# Altium schematic sheet Chipset.SchDoc
size 594 x 420 mm
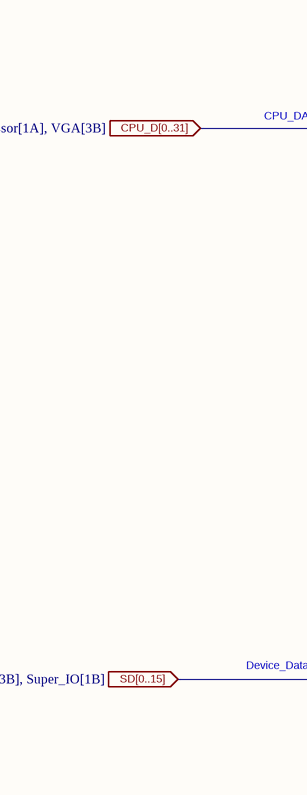
[diagram p0: Chipset.SchDoc, top left]
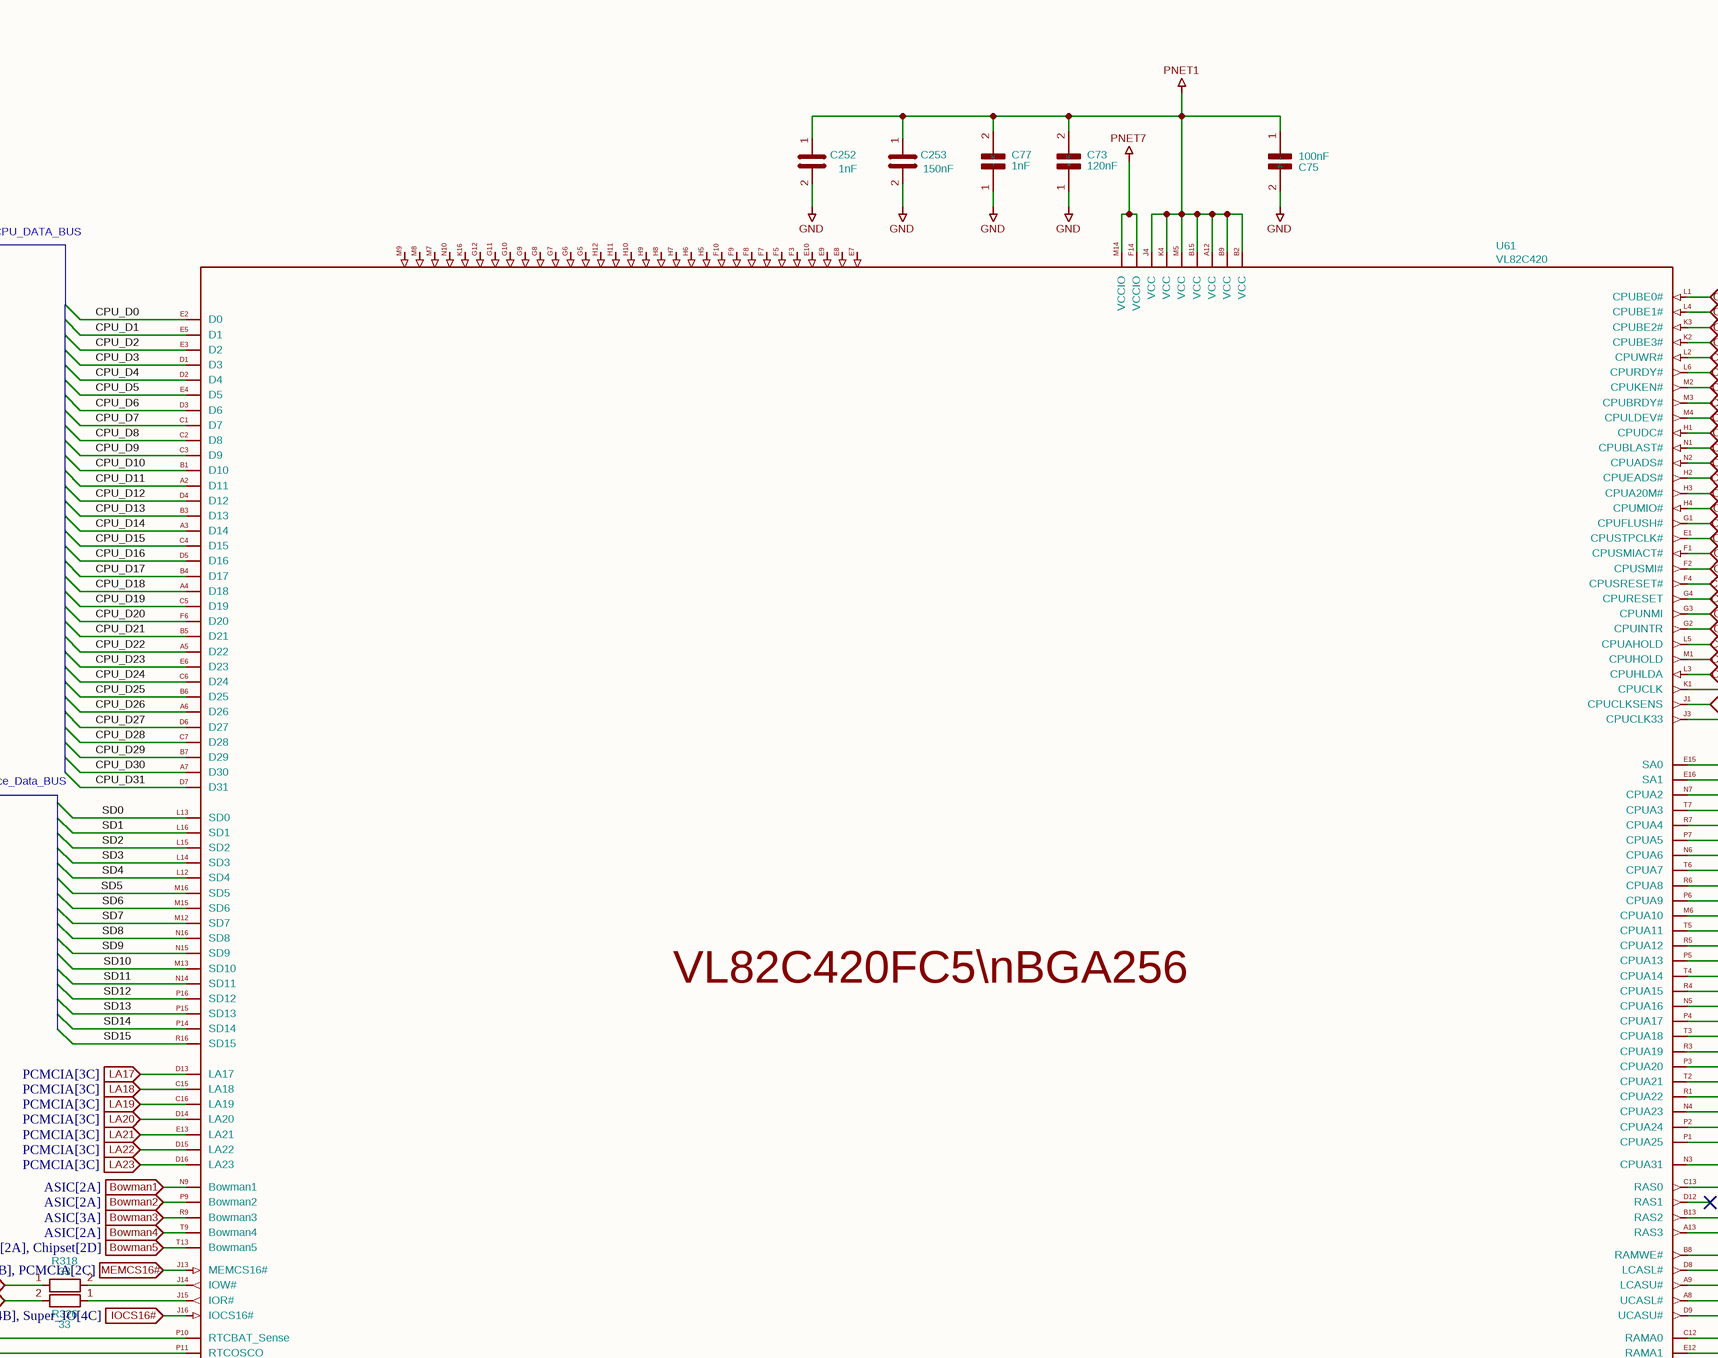
[diagram p1: Chipset.SchDoc, top middle]
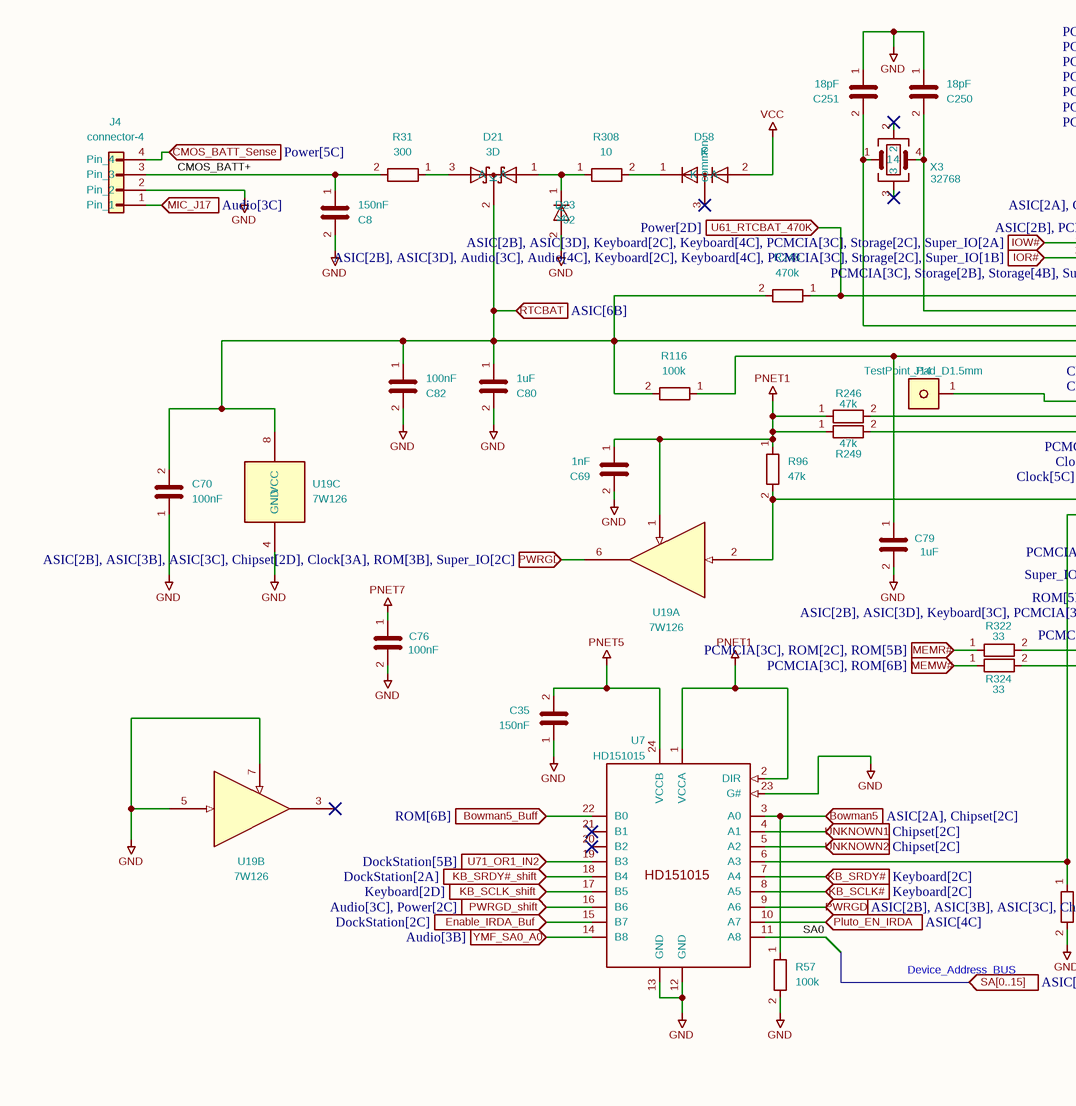
[diagram p2: Chipset.SchDoc, bottom left]
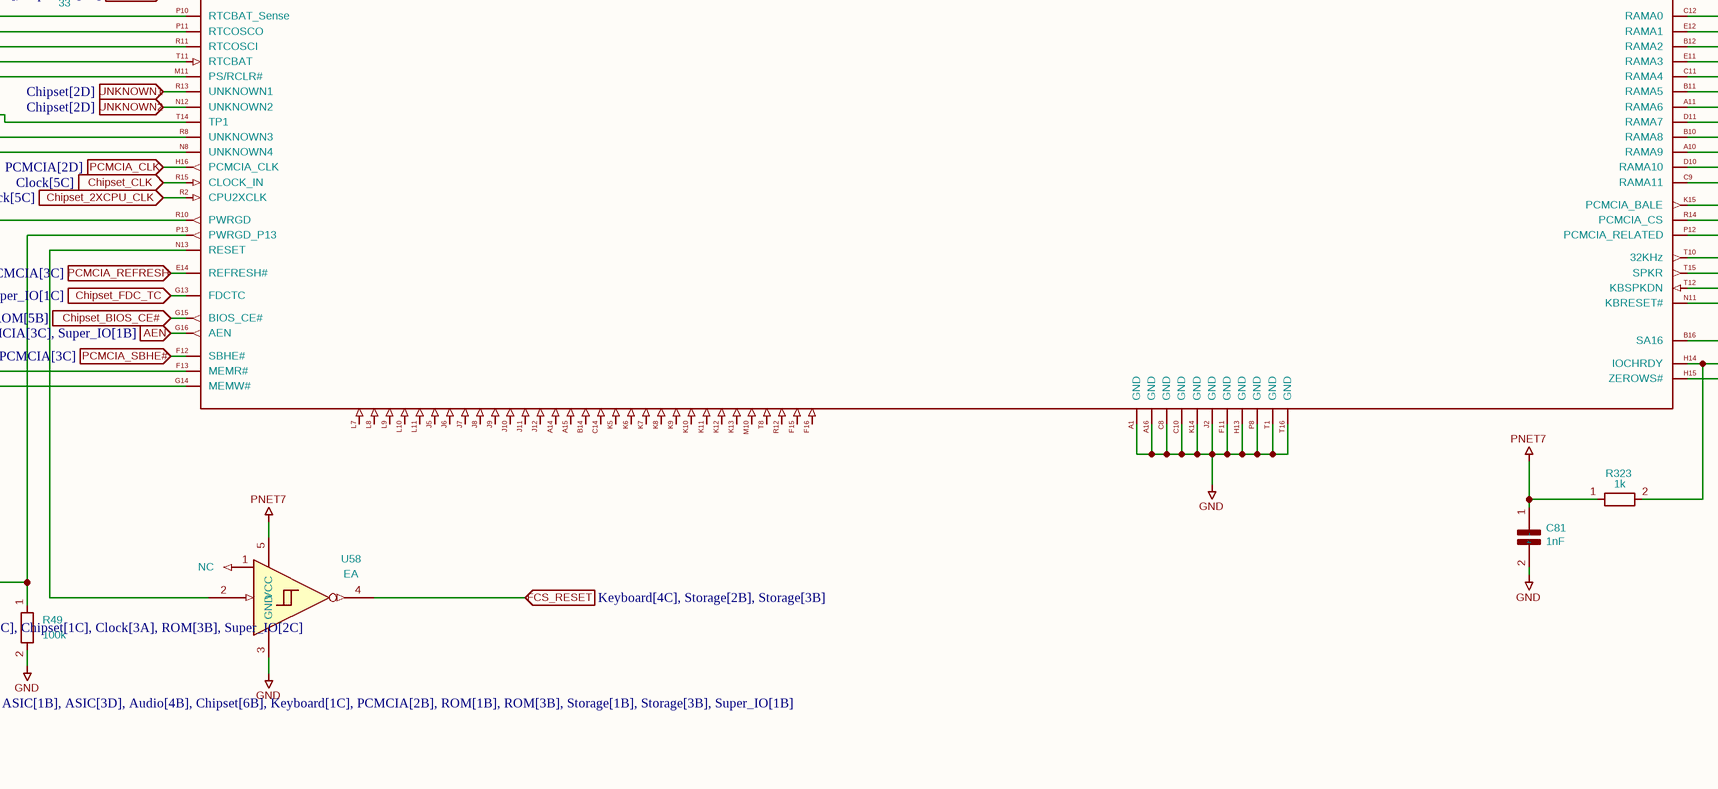
[diagram p3: Chipset.SchDoc, bottom middle]
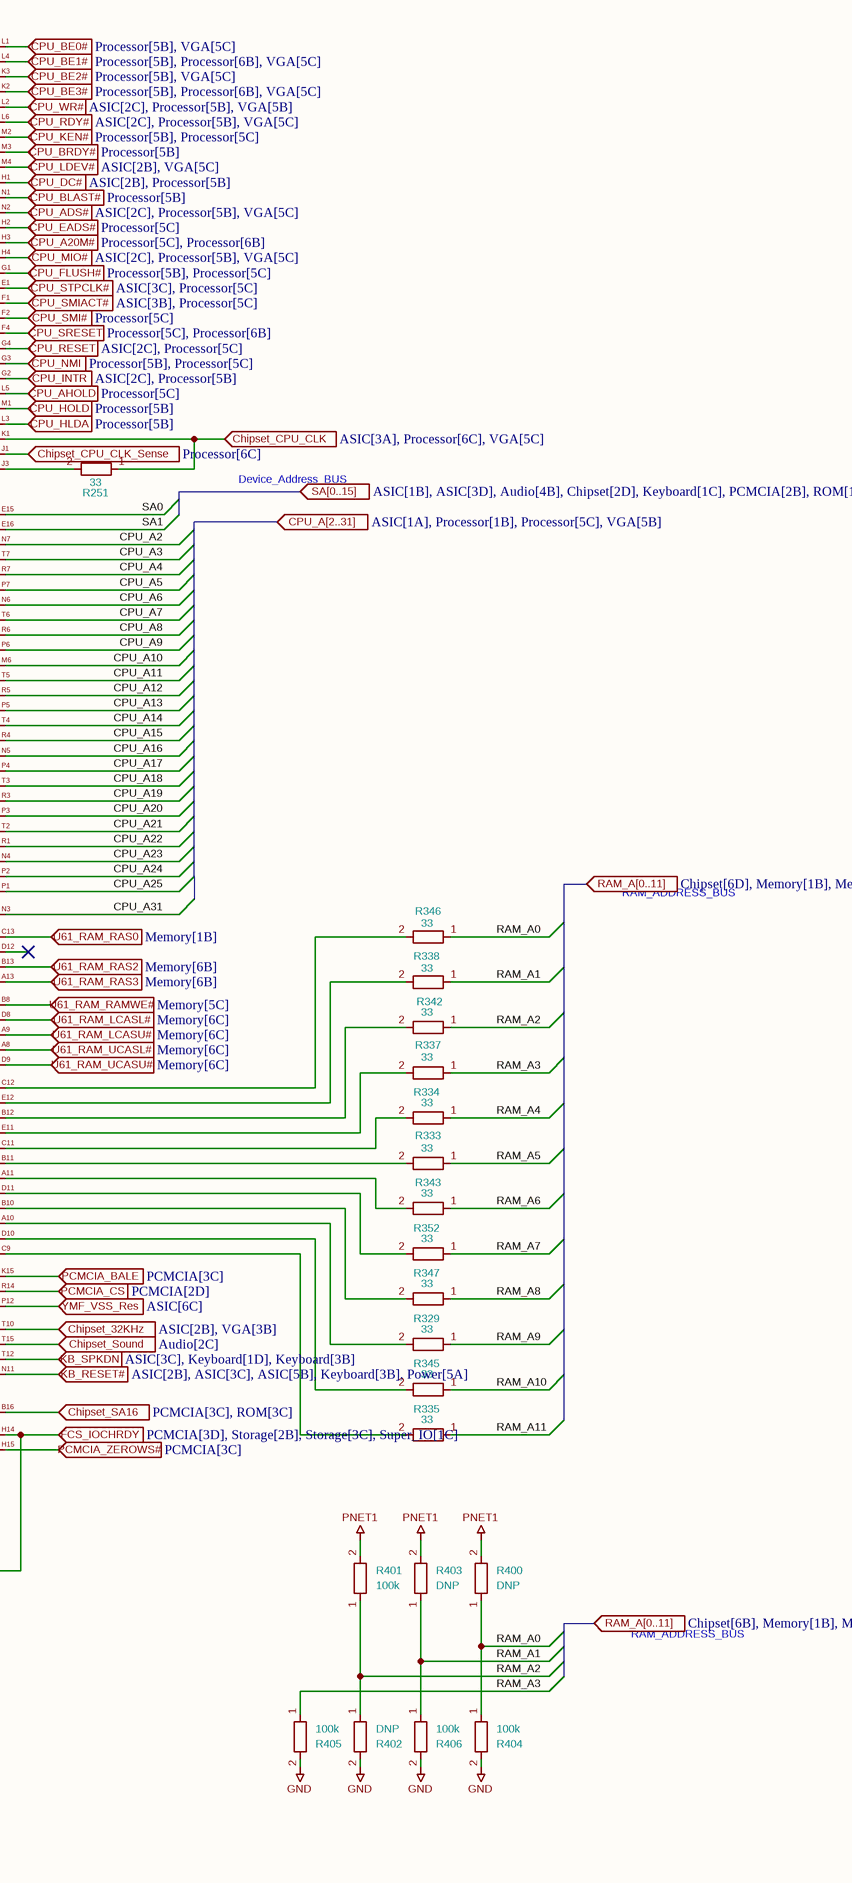
[diagram p4: Chipset.SchDoc, bottom right]

## Parts
C8  150nF  [C_0402_1005Metric]
C35  150nF  [C_0402_1005Metric]
C69  1nF  [C_0402_1005Metric]
C70  100nF  [C_0402_1005Metric]
C73  120nF  [C_0402_1005Metric]
C75  100nF  [C_0402_1005Metric]
C76  100nF  [C_0402_1005Metric]
C77  1nF  [C_0402_1005Metric]
C79  1uF  [C_0603_1608Metric]
C80  1uF  [C_0603_1608Metric]
C81  1nF  [C_0402_1005Metric]
C82  100nF  [C_0402_1005Metric]
C250  18pF  [C_0402_1005Metric]
C251  18pF  [C_0402_1005Metric]
C252  1nF  [C_0402_1005Metric]
C253  150nF  [C_0402_1005Metric]
D21  3D  [3D]
D23  92  [D_0603_1608Metric]
D58  K  [SOT-416L]
J4  connector-4  [connector-4]
J14  TestPoint_Pad_D1.5mm  [TestPoint_Pad_D1.5mm]
R31  300  [R_0402_1005Metric]
R49  100k  [R_0402_1005Metric]
R57  100k  [R_0402_1005Metric]
R96  47k  [R_0402_1005Metric]
R116  100k  [R_0402_1005Metric]
R246  47k  [R_0402_1005Metric]
R248  470k  [R_0402_1005Metric]
R249  47k  [R_0402_1005Metric]
R251  33  [R_0402_1005Metric]
R308  10  [R_0402_1005Metric]
R318  33  [R_0402_1005Metric]
R322  33  [R_0402_1005Metric]
R323  1k  [R_0402_1005Metric]
R324  33  [R_0402_1005Metric]
R326  33  [R_0402_1005Metric]
R329  33  [R_0402_1005Metric]
R333  33  [R_0402_1005Metric]
R334  33  [R_0402_1005Metric]
R335  33  [R_0402_1005Metric]
R337  33  [R_0402_1005Metric]
R338  33  [R_0402_1005Metric]
R342  33  [R_0402_1005Metric]
R343  33  [R_0402_1005Metric]
R345  33  [R_0402_1005Metric]
R346  33  [R_0402_1005Metric]
R347  33  [R_0402_1005Metric]
R352  33  [R_0402_1005Metric]
R400  DNP  [R_0402_1005Metric]
R401  100k  [R_0402_1005Metric]
R402  DNP  [R_0402_1005Metric]
R403  DNP  [R_0402_1005Metric]
R404  100k  [R_0402_1005Metric]
R405  100k  [R_0402_1005Metric]
R406  100k  [R_0402_1005Metric]
U7  HD151015  [TSSOP-24_6.1x7.8mm_P0.65mm]
U19  7W126  [sso-8]  (parts A,B,C of 3)
U58  EA  [SOT-353]
U61  VL82C420  [BGA-256]
X3  32768  [XTAL-3]

## Ports
AEN (in, see ASIC[2B], ASIC[3D], Keyboard[3C], PCMCIA[3C], Super_IO[1B]), Bowman1 (in, see ASIC[2A]), Bowman2 (in, see ASIC[2A]), Bowman3 (in, see ASIC[3A]), Bowman4 (in, see ASIC[2A]), Bowman5 (in, see ASIC[2A], Chipset[2C]), Bowman5 (in, see ASIC[2A], Chipset[2D]), Bowman5_Buff (in, see ROM[6B]), Chipset_2XCPU_CLK (in, see Clock[5C]), Chipset_32KHz (in, see ASIC[2B], VGA[3B]), Chipset_BIOS_CE# (in, see ROM[5B]), Chipset_CLK (in, see Clock[5C]), Chipset_CPU_CLK (in, see ASIC[3A], Processor[6C], VGA[5C]), Chipset_CPU_CLK_Sense (in, see Processor[6C]), Chipset_FDC_TC (in, see Super_IO[1C]), Chipset_SA16 (in, see PCMCIA[3C], ROM[3C]), Chipset_Sound (in, see Audio[2C]), CMOS_BATT_Sense (in, see Power[5C]), CPU_A20M# (in, see Processor[5C], Processor[6B]), CPU_A[2..31] (in, see ASIC[1A], Processor[1B], Processor[5C], VGA[5B]), CPU_ADS# (in, see ASIC[2C], Processor[5B], VGA[5C]), CPU_AHOLD (in, see Processor[5C]), CPU_BE0# (in, see Processor[5B], VGA[5C]), CPU_BE1# (in, see Processor[5B], Processor[6B], VGA[5C]), CPU_BE2# (in, see Processor[5B], VGA[5C]), CPU_BE3# (in, see Processor[5B], Processor[6B], VGA[5C]), CPU_BLAST# (in, see Processor[5B]), CPU_BRDY# (in, see Processor[5B]), CPU_D[0..31] (in, see Memory[3B], Memory[3C], Processor[1A], VGA[3B]), CPU_DC# (in, see ASIC[2B], Processor[5B]), CPU_EADS# (in, see Processor[5C]), CPU_FLUSH# (in, see Processor[5B], Processor[5C]), CPU_HLDA (in, see Processor[5B]), CPU_HOLD (in, see Processor[5B]), CPU_INTR (in, see ASIC[2C], Processor[5B]), CPU_KEN# (in, see Processor[5B], Processor[5C]), CPU_LDEV# (in, see ASIC[2B], VGA[5C]), CPU_MIO# (in, see ASIC[2C], Processor[5B], VGA[5C]), CPU_NMI (in, see Processor[5B], Processor[5C]), CPU_RDY# (in, see ASIC[2C], Processor[5B], VGA[5C]), CPU_RESET (in, see ASIC[2C], Processor[5C]), CPU_SMI# (in, see Processor[5C]), CPU_SMIACT# (in, see ASIC[3B], Processor[5C]), CPU_SRESET (in, see Processor[5C], Processor[6B]), CPU_STPCLK# (in, see ASIC[3C], Processor[5C]), CPU_WR# (in, see ASIC[2C], Processor[5B], VGA[5B]), Enable_IRDA_Buf (in, see DockStation[2C]), FCS_IOCHRDY (in, see PCMCIA[3D], Storage[2B], Storage[3C], Super_IO[1C]), FCS_RESET (in, see Keyboard[4C], Storage[2B], Storage[3B]), IOCS16# (in, see PCMCIA[3C], Storage[2B], Storage[4B], Super_IO[4C]), IOR# (in, see ASIC[2B], ASIC[3D], Audio[3C], Audio[4C], Keyboard[2C], Keyboard[4C], PCMCIA[3C], Storage[2C], Super_IO[1B]), IOW# (in, see ASIC[2B], ASIC[3D], Keyboard[2C], Keyboard[4C], PCMCIA[3C], Storage[2C], Super_IO[2A]), KB_RESET# (in, see ASIC[2B], ASIC[3C], ASIC[5B], Keyboard[3B], Power[5A]), KB_SCLK# (in, see Keyboard[2C]), KB_SCLK_shift (in, see Keyboard[2D]), KB_SPKDN (in, see ASIC[3C], Keyboard[1D], Keyboard[3B]), KB_SRDY# (in, see Keyboard[2C]), KB_SRDY#_shift (in, see DockStation[2A]), LA17 (in, see PCMCIA[3C]), LA18 (in, see PCMCIA[3C]), LA19 (in, see PCMCIA[3C]), LA20 (in, see PCMCIA[3C]), LA21 (in, see PCMCIA[3C]), LA22 (in, see PCMCIA[3C]), LA23 (in, see PCMCIA[3C]), MEMCS16# (in, see ASIC[2B], PCMCIA[2C]), MEMR# (in, see PCMCIA[3C], ROM[2C], ROM[5B]), MEMW# (in, see PCMCIA[3C], ROM[6B]), MIC_J17 (in, see Audio[3C]), PCMCIA_BALE (in, see PCMCIA[3C]), PCMCIA_CLK (in, see PCMCIA[2D]), PCMCIA_CS (in, see PCMCIA[2D]), PCMCIA_REFRESH (in, see PCMCIA[3C]), PCMCIA_SBHE# (in, see PCMCIA[3C]), PCMCIA_ZEROWS# (in, see PCMCIA[3C]), Pluto_EN_IRDA (in, see ASIC[4C]), PWRGD (in, see ASIC[2B], ASIC[3B], ASIC[3C], Chipset[1C], Clock[3A], ROM[3B], Super_IO[2C]), PWRGD (in, see ASIC[2B], ASIC[3B], ASIC[3C], Chipset[2D], Clock[3A], ROM[3B], Super_IO[2C]), PWRGD_shift (in, see Audio[3C], Power[2C]), RAM_A[0..11] (in, see Chipset[6B], Memory[1B], Memory[1C], Memory[5B]), RAM_A[0..11] (in, see Chipset[6D], Memory[1B], Memory[1C], Memory[5B]), RTCBAT (in, see ASIC[6B]), SA[0..15] (in, see ASIC[1B], ASIC[3D], Audio[4B], Chipset[2D], Keyboard[1C], PCMCIA[2B], ROM[1B], ROM[3B], Storage[1B], Storage[3B], Super_IO[1B]), SA[0..15] (in, see ASIC[1B], ASIC[3D], Audio[4B], Chipset[6B], Keyboard[1C], PCMCIA[2B], ROM[1B], ROM[3B], Storage[1B], Storage[3B], Super_IO[1B]), SD[0..15] (in, see ASIC[1B], ASIC[3C], Audio[3B], Keyboard[1C], PCMCIA[2C], ROM[3B], ROM[5C], Storage[1B], Storage[1C], Storage[3B], Super_IO[1B]), U61_RAM_LCASL# (in, see Memory[6C]), U61_RAM_LCASU# (in, see Memory[6C]), U61_RAM_RAMWE# (in, see Memory[5C]), U61_RAM_RAS0 (in, see Memory[1B]), U61_RAM_RAS2 (in, see Memory[6B]), U61_RAM_RAS3 (in, see Memory[6B]), U61_RAM_UCASL# (in, see Memory[6C]), U61_RAM_UCASU# (in, see Memory[6C]), U61_RTCBAT_470K (in, see Power[2D]), U71_OR1_IN2 (in, see DockStation[5B]), UNKNOWN1 (in, see Chipset[2C]), UNKNOWN1 (in, see Chipset[2D]), UNKNOWN2 (in, see Chipset[2C]), UNKNOWN2 (in, see Chipset[2D]), YMF_SA0_A0 (in, see Audio[3B]), YMF_VSS_Res (in, see ASIC[6C])

## Nets
GND: C8.2 C35.1 C69.2 C70.1 C73.1(+) C75.2(-) C76.2 C77.1(+) C79.2 C80.2 C81.2(-) C82.2 C250.1 C251.1 C252.2 C253.2 D23.2(A) J4.2(Pin_2) R49.2 R57.2 R402.2 R404.2 R405.2 R406.2 U7.12(GND) U7.13(GND) U7.23(G#) U19.4(GND) U19.5 U19.7 U58.3(GND) U61.A1(GND) U61.A16(GND) U61.C8(GND) U61.C10(GND) U61.F11(GND) U61.H13(GND) U61.J2(GND) U61.K14(GND) U61.P8(GND) U61.T1(GND) U61.T16(GND)
PNET1: C69.1 C73.2(-) C75.1(+) C77.2(-) C252.1 C253.1 R96.1 R246.1 R249.1 R400.2 R401.2 R403.2 U7.1(VCCA) U7.2(DIR) U19.1 U61.A12(VCC) U61.B2(VCC) U61.B9(VCC) U61.B15(VCC) U61.J4(VCC) U61.K4(VCC) U61.M5(VCC)
PNET5: C35.2 U7.24(VCCB)
PNET7: C76.1 C81.1(+) R323.1 U58.5(VCC) U61.F14(VCCIO) U61.M14(VCCIO)
VCC: D58.2(A)
AEN: U61.G16(AEN) ; port AEN
Bowman1: U61.N9(Bowman1) ; port Bowman1
Bowman2: U61.P9(Bowman2) ; port Bowman2
Bowman3: U61.R9(Bowman3) ; port Bowman3
Bowman4: U61.T9(Bowman4) ; port Bowman4
Bowman5: R57.1 U7.3(A0) U61.T13(Bowman5) ; port Bowman5
Bowman5_Buff: U7.22(B0) ; port Bowman5_Buff
Chipset_2XCPU_CLK: U61.R2(CPU2XCLK) ; port Chipset_2XCPU_CLK
Chipset_32KHz: U61.T10(32KHz) ; port Chipset_32KHz
Chipset_BIOS_CE#: U61.G15(BIOS_CE#) ; port Chipset_BIOS_CE#
Chipset_CLK: U61.R15(CLOCK_IN) ; port Chipset_CLK
Chipset_CPU_CLK: R251.1 U61.K1(CPUCLK) ; port Chipset_CPU_CLK
Chipset_CPU_CLK_Sense: U61.J1(CPUCLKSENS) ; port Chipset_CPU_CLK_Sense
Chipset_FDC_TC: U61.G13(FDCTC) ; port Chipset_FDC_TC
Chipset_SA16: U61.B16(SA16) ; port Chipset_SA16
Chipset_Sound: U61.T15(SPKR) ; port Chipset_Sound
CMOS_BATT+: C8.1 J4.3(Pin_3) R31.2
CMOS_BATT_Sense: J4.4(Pin_4) ; port CMOS_BATT_Sense
CPU_A2: U61.N7(CPUA2)
CPU_A3: U61.T7(CPUA3)
CPU_A4: U61.R7(CPUA4)
CPU_A5: U61.P7(CPUA5)
CPU_A6: U61.N6(CPUA6)
CPU_A7: U61.T6(CPUA7)
CPU_A8: U61.R6(CPUA8)
CPU_A9: U61.P6(CPUA9)
CPU_A10: U61.M6(CPUA10)
CPU_A11: U61.T5(CPUA11)
CPU_A12: U61.R5(CPUA12)
CPU_A13: U61.P5(CPUA13)
CPU_A14: U61.T4(CPUA14)
CPU_A15: U61.R4(CPUA15)
CPU_A16: U61.N5(CPUA16)
CPU_A17: U61.P4(CPUA17)
CPU_A18: U61.T3(CPUA18)
CPU_A19: U61.R3(CPUA19)
CPU_A20: U61.P3(CPUA20)
CPU_A20M#: U61.H3(CPUA20M#) ; port CPU_A20M#
CPU_A21: U61.T2(CPUA21)
CPU_A22: U61.R1(CPUA22)
CPU_A23: U61.N4(CPUA23)
CPU_A24: U61.P2(CPUA24)
CPU_A25: U61.P1(CPUA25)
CPU_A31: U61.N3(CPUA31)
CPU_ADS#: U61.N2(CPUADS#) ; port CPU_ADS#
CPU_AHOLD: U61.L5(CPUAHOLD) ; port CPU_AHOLD
CPU_BE0#: U61.L1(CPUBE0#) ; port CPU_BE0#
CPU_BE1#: U61.L4(CPUBE1#) ; port CPU_BE1#
CPU_BE2#: U61.K3(CPUBE2#) ; port CPU_BE2#
CPU_BE3#: U61.K2(CPUBE3#) ; port CPU_BE3#
CPU_BLAST#: U61.N1(CPUBLAST#) ; port CPU_BLAST#
CPU_BRDY#: U61.M3(CPUBRDY#) ; port CPU_BRDY#
CPU_D0: U61.E2(D0)
CPU_D1: U61.E5(D1)
CPU_D2: U61.E3(D2)
CPU_D3: U61.D1(D3)
CPU_D4: U61.D2(D4)
CPU_D5: U61.E4(D5)
CPU_D6: U61.D3(D6)
CPU_D7: U61.C1(D7)
CPU_D8: U61.C2(D8)
CPU_D9: U61.C3(D9)
CPU_D10: U61.B1(D10)
CPU_D11: U61.A2(D11)
CPU_D12: U61.D4(D12)
CPU_D13: U61.B3(D13)
CPU_D14: U61.A3(D14)
CPU_D15: U61.C4(D15)
CPU_D16: U61.D5(D16)
CPU_D17: U61.B4(D17)
CPU_D18: U61.A4(D18)
CPU_D19: U61.C5(D19)
CPU_D20: U61.F6(D20)
CPU_D21: U61.B5(D21)
CPU_D22: U61.A5(D22)
CPU_D23: U61.E6(D23)
CPU_D24: U61.C6(D24)
CPU_D25: U61.B6(D25)
CPU_D26: U61.A6(D26)
CPU_D27: U61.D6(D27)
CPU_D28: U61.C7(D28)
CPU_D29: U61.B7(D29)
CPU_D30: U61.A7(D30)
CPU_D31: U61.D7(D31)
CPU_DC#: U61.H1(CPUDC#) ; port CPU_DC#
CPU_EADS#: U61.H2(CPUEADS#) ; port CPU_EADS#
CPU_FLUSH#: U61.G1(CPUFLUSH#) ; port CPU_FLUSH#
CPU_HLDA: U61.L3(CPUHLDA) ; port CPU_HLDA
CPU_HOLD: U61.M1(CPUHOLD) ; port CPU_HOLD
CPU_INTR: U61.G2(CPUINTR) ; port CPU_INTR
CPU_KEN#: U61.M2(CPUKEN#) ; port CPU_KEN#
CPU_LDEV#: U61.M4(CPULDEV#) ; port CPU_LDEV#
CPU_MIO#: U61.H4(CPUMIO#) ; port CPU_MIO#
CPU_NMI: U61.G3(CPUNMI) ; port CPU_NMI
CPU_RDY#: U61.L6(CPURDY#) ; port CPU_RDY#
CPU_RESET: U61.G4(CPURESET) ; port CPU_RESET
CPU_SMI#: U61.F2(CPUSMI#) ; port CPU_SMI#
CPU_SMIACT#: U61.F1(CPUSMIACT#) ; port CPU_SMIACT#
CPU_SRESET: U61.F4(CPUSRESET#) ; port CPU_SRESET
CPU_STPCLK#: U61.E1(CPUSTPCLK#) ; port CPU_STPCLK#
CPU_WR#: U61.L2(CPUWR#) ; port CPU_WR#
Enable_IRDA_Buf: U7.15(B7) ; port Enable_IRDA_Buf
FCS_IOCHRDY: R323.2 U61.H14(IOCHRDY) ; port FCS_IOCHRDY
FCS_RESET: U58.4 ; port FCS_RESET
IOCS16#: U61.J16(IOCS16#) ; port IOCS16#
IOR#: R326.2 ; port IOR#
IOW#: R318.1 ; port IOW#
KB_RESET#: U61.N11(KBRESET#) ; port KB_RESET#
KB_SCLK#: U7.8(A5) ; port KB_SCLK#
KB_SCLK_shift: U7.17(B5) ; port KB_SCLK_shift
KB_SPKDN: U61.T12(KBSPKDN) ; port KB_SPKDN
KB_SRDY#: U7.7(A4) ; port KB_SRDY#
KB_SRDY#_shift: U7.18(B4) ; port KB_SRDY#_shift
LA17: U61.D13(LA17) ; port LA17
LA18: U61.C15(LA18) ; port LA18
LA19: U61.C16(LA19) ; port LA19
LA20: U61.D14(LA20) ; port LA20
LA21: U61.E13(LA21) ; port LA21
LA22: U61.D15(LA22) ; port LA22
LA23: U61.D16(LA23) ; port LA23
MEMCS16#: U61.J13(MEMCS16#) ; port MEMCS16#
MEMR#: R322.1 ; port MEMR#
MEMW#: R324.1 ; port MEMW#
MIC_J17: J4.1(Pin_1) ; port MIC_J17
PCMCIA_BALE: U61.K15(PCMCIA_BALE) ; port PCMCIA_BALE
PCMCIA_CLK: U61.H16(PCMCIA_CLK) ; port PCMCIA_CLK
PCMCIA_CS: U61.R14(PCMCIA_CS) ; port PCMCIA_CS
PCMCIA_REFRESH: U61.E14(REFRESH#) ; port PCMCIA_REFRESH
PCMCIA_SBHE#: U61.F12(SBHE#) ; port PCMCIA_SBHE#
PCMCIA_ZEROWS#: U61.H15(ZEROWS#) ; port PCMCIA_ZEROWS#
Pluto_EN_IRDA: U7.10(A7) ; port Pluto_EN_IRDA
PWRGD: U7.9(A6) U19.6 ; port PWRGD
PWRGD_shift: U7.16(B6) ; port PWRGD_shift
RAM_A0: R346.1 R400.1 R404.1
RAM_A1: R338.1 R403.1 R406.1
RAM_A2: R342.1 R401.1 R402.1
RAM_A3: R337.1 R405.1
RAM_A4: R334.1
RAM_A5: R333.1
RAM_A6: R343.1
RAM_A7: R352.1
RAM_A8: R347.1
RAM_A9: R329.1
RAM_A10: R345.1
RAM_A11: R335.1
RTCBAT: C70.2 C80.1 C82.1 D21.2(K) R116.2 R248.2 U19.8(VCC) U61.T11(RTCBAT) ; port RTCBAT
SA0: U7.11(A8) U61.E15(SA0)
SA1: U61.E16(SA1)
SD0: U61.L13(SD0)
SD1: U61.L16(SD1)
SD2: U61.L15(SD2)
SD3: U61.L14(SD3)
SD4: U61.L12(SD4)
SD5: U61.M16(SD5)
SD6: U61.M15(SD6)
SD7: U61.M12(SD7)
SD8: U61.N16(SD8)
SD9: U61.N15(SD9)
SD10: U61.M13(SD10)
SD11: U61.N14(SD11)
SD12: U61.P16(SD12)
SD13: U61.P15(SD13)
SD14: U61.P14(SD14)
SD15: U61.R16(SD15)
U61_RAM_LCASL#: U61.D8(LCASL#) ; port U61_RAM_LCASL#
U61_RAM_LCASU#: U61.A9(LCASU#) ; port U61_RAM_LCASU#
U61_RAM_RAMWE#: U61.B8(RAMWE#) ; port U61_RAM_RAMWE#
U61_RAM_RAS0: U61.C13(RAS0) ; port U61_RAM_RAS0
U61_RAM_RAS2: U61.B13(RAS2) ; port U61_RAM_RAS2
U61_RAM_RAS3: U61.A13(RAS3) ; port U61_RAM_RAS3
U61_RAM_UCASL#: U61.A8(UCASL#) ; port U61_RAM_UCASL#
U61_RAM_UCASU#: U61.D9(UCASU#) ; port U61_RAM_UCASU#
U61_RTCBAT_470K: R248.1 U61.P10(RTCBAT_Sense) ; port U61_RTCBAT_470K
U71_OR1_IN2: U7.19(B3) ; port U71_OR1_IN2
UNKNOWN1: U7.4(A1) U61.R13(UNKNOWN1) ; port UNKNOWN1
UNKNOWN2: U7.5(A2) U61.N12(UNKNOWN2) ; port UNKNOWN2
YMF_SA0_A0: U7.14(B8) ; port YMF_SA0_A0
YMF_VSS_Res: U61.P12(PCMCIA_RELATED) ; port YMF_VSS_Res
NetC79_1: C79.1 R116.1 U61.M11(PS/RCLR#)
NetC250_2: C250.2 U61.P11(RTCOSCO) X3.4
NetC251_2: C251.2 U61.R11(RTCOSCI) X3.1
NetD21_1: D21.1(A) D23.1(K) R308.1
NetD21_3: D21.3(A) R31.1
NetD58_1: D58.1(K) R308.2
NetJ14_1: J14.1 U61.T14(TP1)
NetR49_1: R49.1 U7.6(A3) U61.P13(PWRGD_P13)
NetR96_2: R96.2 U19.2 U61.R10(PWRGD)
NetR246_2: R246.2 U61.R8(UNKNOWN3)
NetR249_2: R249.2 U61.N8(UNKNOWN4)
NetR251_2: R251.2 U61.J3(CPUCLK33)
NetR318_2: R318.2 U61.J14(IOW#)
NetR322_2: R322.2 U61.F13(MEMR#)
NetR324_2: R324.2 U61.G14(MEMW#)
NetR326_1: R326.1 U61.J15(IOR#)
NetR329_2: R329.2 U61.A10(RAMA9)
NetR333_2: R333.2 U61.B11(RAMA5)
NetR334_2: R334.2 U61.C11(RAMA4)
NetR335_2: R335.2 U61.C9(RAMA11)
NetR337_2: R337.2 U61.E11(RAMA3)
NetR338_2: R338.2 U61.E12(RAMA1)
NetR342_2: R342.2 U61.B12(RAMA2)
NetR343_2: R343.2 U61.A11(RAMA6)
NetR345_2: R345.2 U61.D10(RAMA10)
NetR346_2: R346.2 U61.C12(RAMA0)
NetR347_2: R347.2 U61.B10(RAMA8)
NetR352_2: R352.2 U61.D11(RAMA7)
NetU58_2: U58.2 U61.N13(RESET)

Not connected (* = marked no-connect by the designer): D58 3(common)*; U7 20(B2)* 21(B1)*; U19 3*; U58 1(NC); U61 A14 A15 B14 C14 D12(RAS1)* E7 E8 E9 E10 F3 F5 F7 F8 F9 F10 F15 F16 G5 G6 G7 G8 G9 G10 G11 G12 H5 H6 H7 H8 H9 H10 H11 H12 J5 J6 J7 J8 J9 J10 J11 J12 K5 K6 K7 K8 K9 K10 K11 K12 K13 K16 L7 L8 L9 L10 L11 M7 M8 M9 M10 N10 R12 T8; X3 2* 3*

## Notes on the sheet
- CPU_DATA_BUS
- Device_Address_BUS
- Device_Data_BUS
- RAM_ADDRESS_BUS
- 1
- 2
- 3
- 4
- 5
- 6
- 7
- 8
- 9
- 10
- 11
- A
- B
- C
- D
- E
- F
- G
- H
- Title: PC110
- File: Chipset.kicad_sch
- Sheet: /
- Recreated by: Ahmad Byagowi
- KiCad E.D.A.  kicad (5.1.4)-1
- Size: A2
- Date:
- Rev:
- Id: 1/1
- (in symbol VL82C420) VL82C420FC5\nBGA256

## Library data of the parts
C8 C35 C69 C70 C73 C75-C77 C79-C82 C250-C253 = C
  C8 C35 C253: Value: 150nF; Footprint: Capacitor_SMD:C_0402_1005Metric
  C69 C77 C81 C252: Value: 1nF; Footprint: Capacitor_SMD:C_0402_1005Metric
  C70 C75 C76 C82: Value: 100nF; Footprint: Capacitor_SMD:C_0402_1005Metric
  C73: Value: 120nF; Footprint: Capacitor_SMD:C_0402_1005Metric
  C79 C80: Value: 1uF; Footprint: Capacitor_SMD:C_0603_1608Metric
  C250 C251: Value: 18pF; Footprint: Capacitor_SMD:C_0402_1005Metric
D21 = D_Schottky_Dual_CommonCathode_AKA: Value: 3D; Footprint: PC110:3D
D23 = D: Value: 92; Footprint: Diode_SMD:D_0603_1608Metric
D58 = D_Dual_Series_KAC: Value: K; Footprint: PC110:SOT-416L
J4 = Conn_01x04: Value: connector-4; Footprint: PC110:connector-4
J14 = Debug1: Value: TestPoint_Pad_D1.5mm; Footprint: TestPoint:TestPoint_Pad_D1.5mm
R31 R49 R57 R96 R116 R246 R248 R249 R251 R308 R318 R322-R324 R326 R329 R333-R335 R337 R338 R342 R343 R345-R347 R352 R400-R406 = R
  R31: Value: 300; Footprint: PCM_Resistor_SMD_AKL:R_0402_1005Metric
  R49 R57 R116 R401 R404-R406: Value: 100k; Footprint: PCM_Resistor_SMD_AKL:R_0402_1005Metric
  R96: Value: 47k; Footprint: PCM_Resistor_SMD_AKL:R_0402_1005Metric
  R246 R249: Value: 47k; Footprint: Resistor_SMD:R_0402_1005Metric
  R248: Value: 470k; Footprint: Resistor_SMD:R_0402_1005Metric
  R251: Value: 33; Footprint: Resistor_SMD:R_0402_1005Metric
  R308: Value: 10; Footprint: Resistor_SMD:R_0402_1005Metric
  R318 R322 R324 R326 R329 R333-R335 R337 R338 R342 R343 R345-R347 R352: Value: 33; Footprint: PCM_Resistor_SMD_AKL:R_0402_1005Metric
  R323: Value: 1k; Footprint: PCM_Resistor_SMD_AKL:R_0402_1005Metric
  R400 R402 R403: Value: DNP; Footprint: PCM_Resistor_SMD_AKL:R_0402_1005Metric
U19 = 74AUC2G126: Value: 7W126; Footprint: PC110:sso-8
U58 = 74AHC1G14: Value: EA; Footprint: PC110:SOT-353
X3 = Crystal_GND23: Value: 32768; Footprint: PC110:XTAL-3
U7 = HD151015: Value: HD151015; Footprint: Package_SO:TSSOP-24_6.1x7.8mm_P0.65mm
U61 = VL82C420: Value: VL82C420; Footprint: PC110:BGA-256